# Altium schematic sheet Connector_SOM40.SchDoc: =SheetTitle_Top
size 420 x 297 mm; EDA_Number: ARTIQ; Author: G.Kasprowicz; CompanyName: WUT ISE; DrawnBy: G.Kasprowicz; Organization: WUT ISE; Address1: PW ISE; Address2: Nowowiejska 15/19 00-665 Warsaw; Address3: gkasprow@gmail.com; ModifiedBy: -; CheckedDate: -; Title2: K24 SOM40 Connector; DivGrp: WUT ISE; Designer: G.Kasprowicz; ModifiedDate: -; ProjectName: Sensor Box
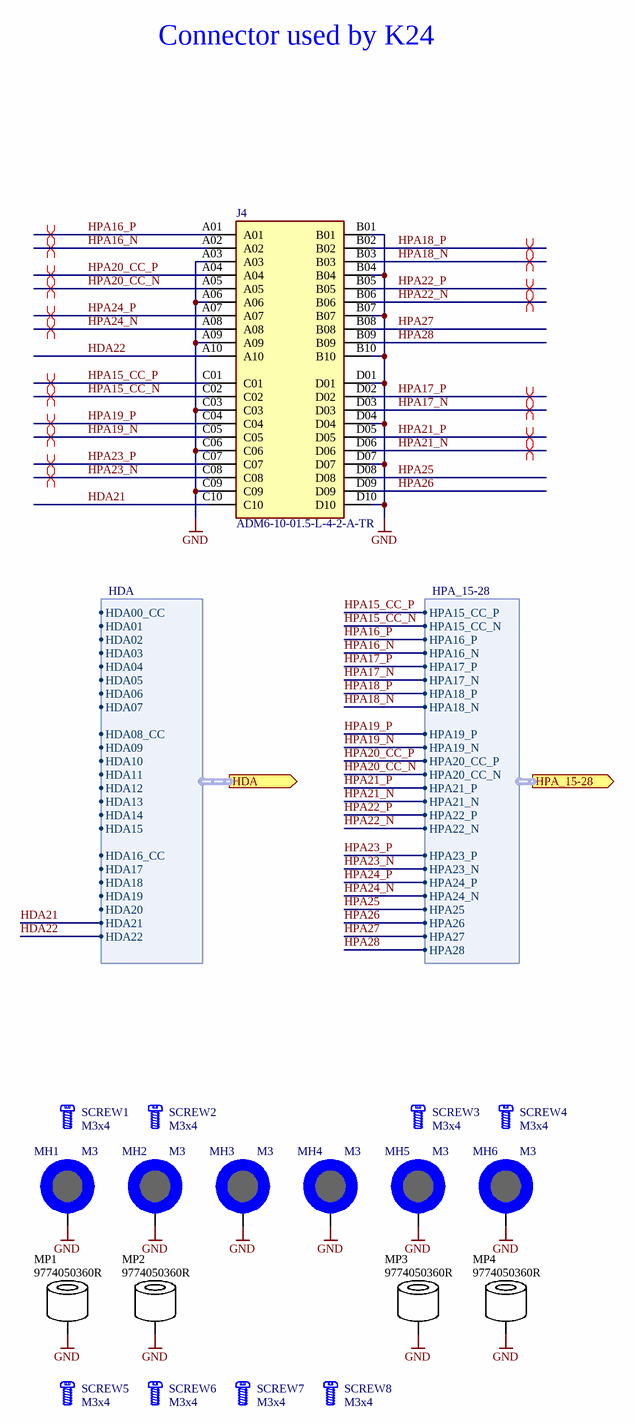
[diagram p0: Connector_SOM40.SchDoc]

## Parts
J4  ADM6-10-01.5-L-4-2-A-TR  [SAMTEC_ADM6-10-01.5-L-4-2-A-TR]
MH1  M3  [MH-M3_COPPER]  (no BOM)
MH2  M3  [MH-M3_COPPER]  (no BOM)
MH3  M3  [MH-M3_COPPER]  (no BOM)
MH4  M3  [MH-M3_COPPER]  (no BOM)
MH5  M3  [MH-M3_COPPER]  (no BOM)
MH6  M3  [MH-M3_COPPER]  (no BOM)
MP1  9774050360R  [9774050960R]
MP2  9774050360R  [9774050960R]
MP3  9774050360R  [9774050960R]
MP4  9774050360R  [9774050960R]
SCREW1  M3x4  [KRAFTBERG_M3X4/ISO7380-1-A2-K26]
SCREW2  M3x4  [KRAFTBERG_M3X4/ISO7380-1-A2-K26]
SCREW3  M3x4  [KRAFTBERG_M3X4/ISO7380-1-A2-K26]
SCREW4  M3x4  [KRAFTBERG_M3X4/ISO7380-1-A2-K26]
SCREW5  M3x4  [KRAFTBERG_M3X4/ISO7380-1-A2-K24]
SCREW6  M3x4  [KRAFTBERG_M3X4/ISO7380-1-A2-K24]
SCREW7  M3x4  [KRAFTBERG_M3X4/ISO7380-1-A2-K24]
SCREW8  M3x4  [KRAFTBERG_M3X4/ISO7380-1-A2-K24]

## Ports
HDA (out, harness HDA), HPA_15-28 (out, harness HPA_15-28)

## Harnesses
HPA_15-28: HPA15_CC_P, HPA15_CC_N, HPA16_P, HPA16_N, HPA17_P, HPA17_N, HPA18_P, HPA18_N, HPA19_P, HPA19_N, HPA20_CC_P, HPA20_CC_N, HPA21_P, HPA21_N, HPA22_P, HPA22_N, HPA23_P, HPA23_N, HPA24_P, HPA24_N, HPA25, HPA26, HPA27, HPA28
HDA: HDA00_CC, HDA01, HDA02, HDA03, HDA04, HDA06, HDA07, HDA05, HDA08_CC, HDA09, HDA10, HDA11, HDA12, HDA13, HDA14, HDA15, HDA16_CC, HDA17, HDA18, HDA19, HDA20, HDA21, HDA22

## Nets
GND: J4.A03 J4.A06 J4.A09 J4.B01 J4.B04 J4.B07 J4.B10 J4.C03 J4.C06 J4.C09 J4.D01 J4.D04 J4.D07 J4.D10 MH1.MH MH2.MH MH3.MH MH4.MH MH5.MH MH6.MH MP1.1 MP2.1 MP3.1 MP4.1
HDA21: J4.C10 ; port HDA.HDA21
HDA22: J4.A10 ; port HDA.HDA22
HPA15_CC_N: J4.C02 ; port HPA_15-28.HPA15_CC_N
HPA15_CC_P: J4.C01 ; port HPA_15-28.HPA15_CC_P
HPA16_N: J4.A02 ; port HPA_15-28.HPA16_N
HPA16_P: J4.A01 ; port HPA_15-28.HPA16_P
HPA17_N: J4.D03 ; port HPA_15-28.HPA17_N
HPA17_P: J4.D02 ; port HPA_15-28.HPA17_P
HPA18_N: J4.B03 ; port HPA_15-28.HPA18_N
HPA18_P: J4.B02 ; port HPA_15-28.HPA18_P
HPA19_N: J4.C05 ; port HPA_15-28.HPA19_N
HPA19_P: J4.C04 ; port HPA_15-28.HPA19_P
HPA20_CC_N: J4.A05 ; port HPA_15-28.HPA20_CC_N
HPA20_CC_P: J4.A04 ; port HPA_15-28.HPA20_CC_P
HPA21_N: J4.D06 ; port HPA_15-28.HPA21_N
HPA21_P: J4.D05 ; port HPA_15-28.HPA21_P
HPA22_N: J4.B06 ; port HPA_15-28.HPA22_N
HPA22_P: J4.B05 ; port HPA_15-28.HPA22_P
HPA23_N: J4.C08 ; port HPA_15-28.HPA23_N
HPA23_P: J4.C07 ; port HPA_15-28.HPA23_P
HPA24_N: J4.A08 ; port HPA_15-28.HPA24_N
HPA24_P: J4.A07 ; port HPA_15-28.HPA24_P
HPA25: J4.D08 ; port HPA_15-28.HPA25
HPA26: J4.D09 ; port HPA_15-28.HPA26
HPA27: J4.B08 ; port HPA_15-28.HPA27
HPA28: J4.B09 ; port HPA_15-28.HPA28

## Layout directives
differential pair; differential pair class Diff_HPC: HPA15_CC_N, HPA15_CC_P, HPA16_N, HPA16_P, HPA17_N, HPA17_P, HPA18_N, HPA18_P, HPA19_N, HPA19_P, HPA20_CC_N, HPA20_CC_P, HPA21_N, HPA21_P, HPA22_N, HPA22_P, HPA23_N, HPA23_P, HPA24_N, HPA24_P

## Notes on the sheet
- Connector used by K24
- Project/Equipment
- Document
- Designer
- Drawn by
- Check.by
- Copyright WUT ISE 2020.
  This documentation describes Open Hardware and is licensed under the CERN OHL v.1.2. You may redistribute and modify this documentation under the terms of the CERN OHL v.1.2. (http://ohwr.org/CERNOHL). This documentation is distributed WITHOUT ANY EXPRESS OR IMPLIED WARRANTY, INCLUDING OF MERCHANTABILITY, SATISFACTORY QUALITY AND FITNESS FOR A PARTICULAR PURPOSE. Please see the CERN OHL v.1.2 for applicable conditions.
- Contact
- File
- Last Mod.
- Print Date
- Sheet
- Size
- A3
- of
- Rev

## Library data of the parts
J4 = ADM6-10-01.5-L-4-2-A-TR: Manufacturer: Samtec; Part Number: ADM6-10-01.5-L-4-2-A-TR
MH1-MH6 = MH-M3_C: Mounting hole, M3, exposed pad; DesignItemId: MH-M3_C; Author: KB; Family: M3; Part Description: Mounting hole, M3, exposed pad; Create Date: 11/05/2019; LatestRevisionDate: 11/05/2019
MP1-MP4 = 9774050960R: MP; Manufacturer: Würth Elektronik; Part Number: 9774050360R
SCREW1-SCREW8 = Screw: Part Number: KRAFTBERG_M3X4/ISO7380-1-A2; Part Description: M3 L=4mm Hexalobular Socket Pan Head Screw, Fully Threaded, Stainless Steel A2; Manufacturer: KRAFTBERG; Manufacturer Part Number: M3X4/ISO7380-1-A2; PressFit: No; Component Kind: Standard; Component Type: Mechanical; Footprint: KRAFTBERG_M3X4/ISO7380-1-A2; Pin Count: 0; PackageDescription: M3 L=4mm Hexalobular Socket Pan Head Screw, Fully Threaded - Stainless Steel A2; Mounted: Yes; Socket: No; SMD: No; Sense: No; Status: None; Value: M3x4; ComponentHeight: 5.65mm; HelpURL: \\cern.ch\dfs\Applications\Altium\Datasheets\BOSSARD_BN5687-3061605.pdf; Author: CERN DEM JLC; CreateDate: 15/01/2013; LatestRevisionDate: 15/01/2013